# EAGLE schematic PCB (EAGLE 9.6.2)
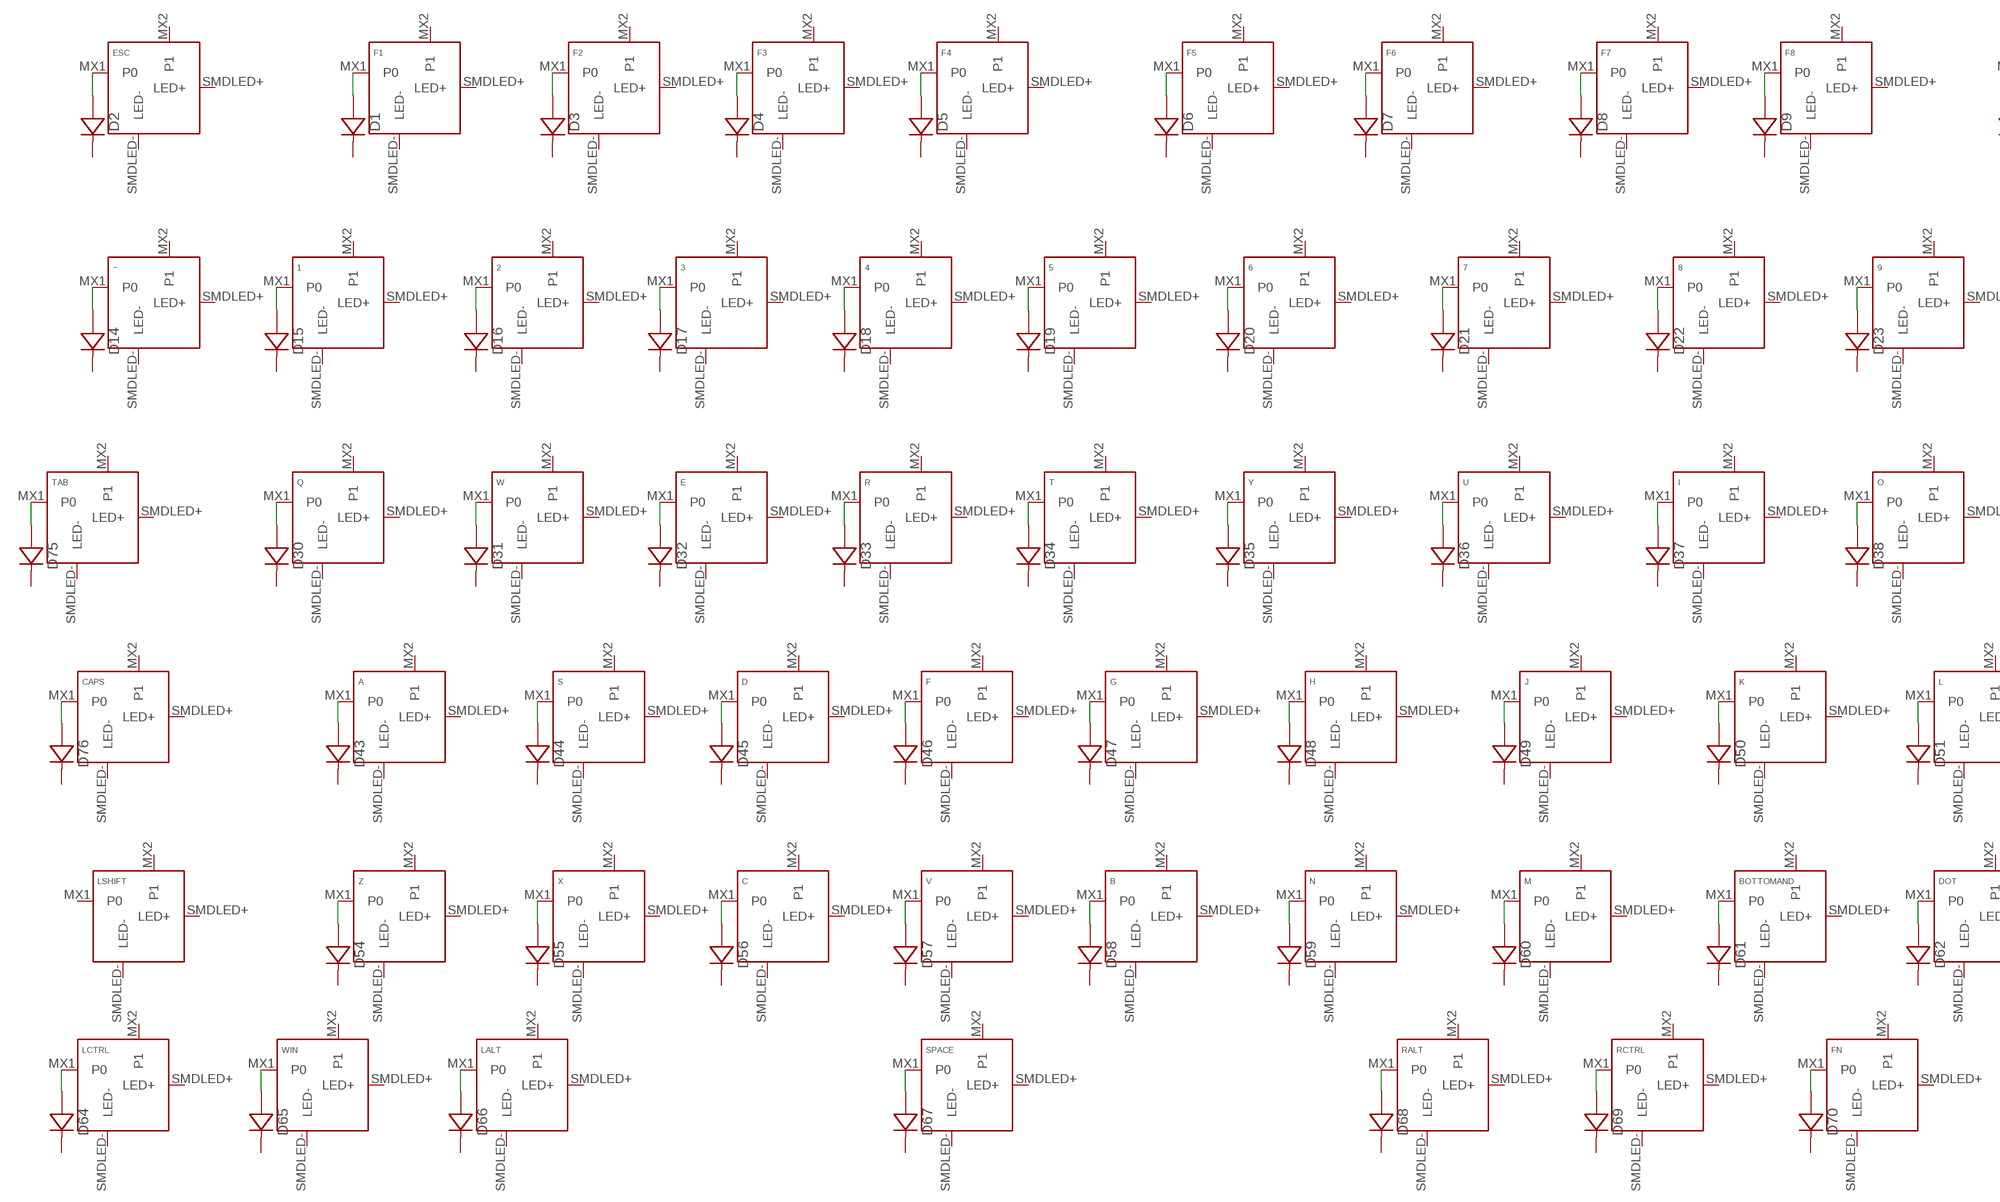
[diagram p0: schematic, sheet 1, part 1 of 2]
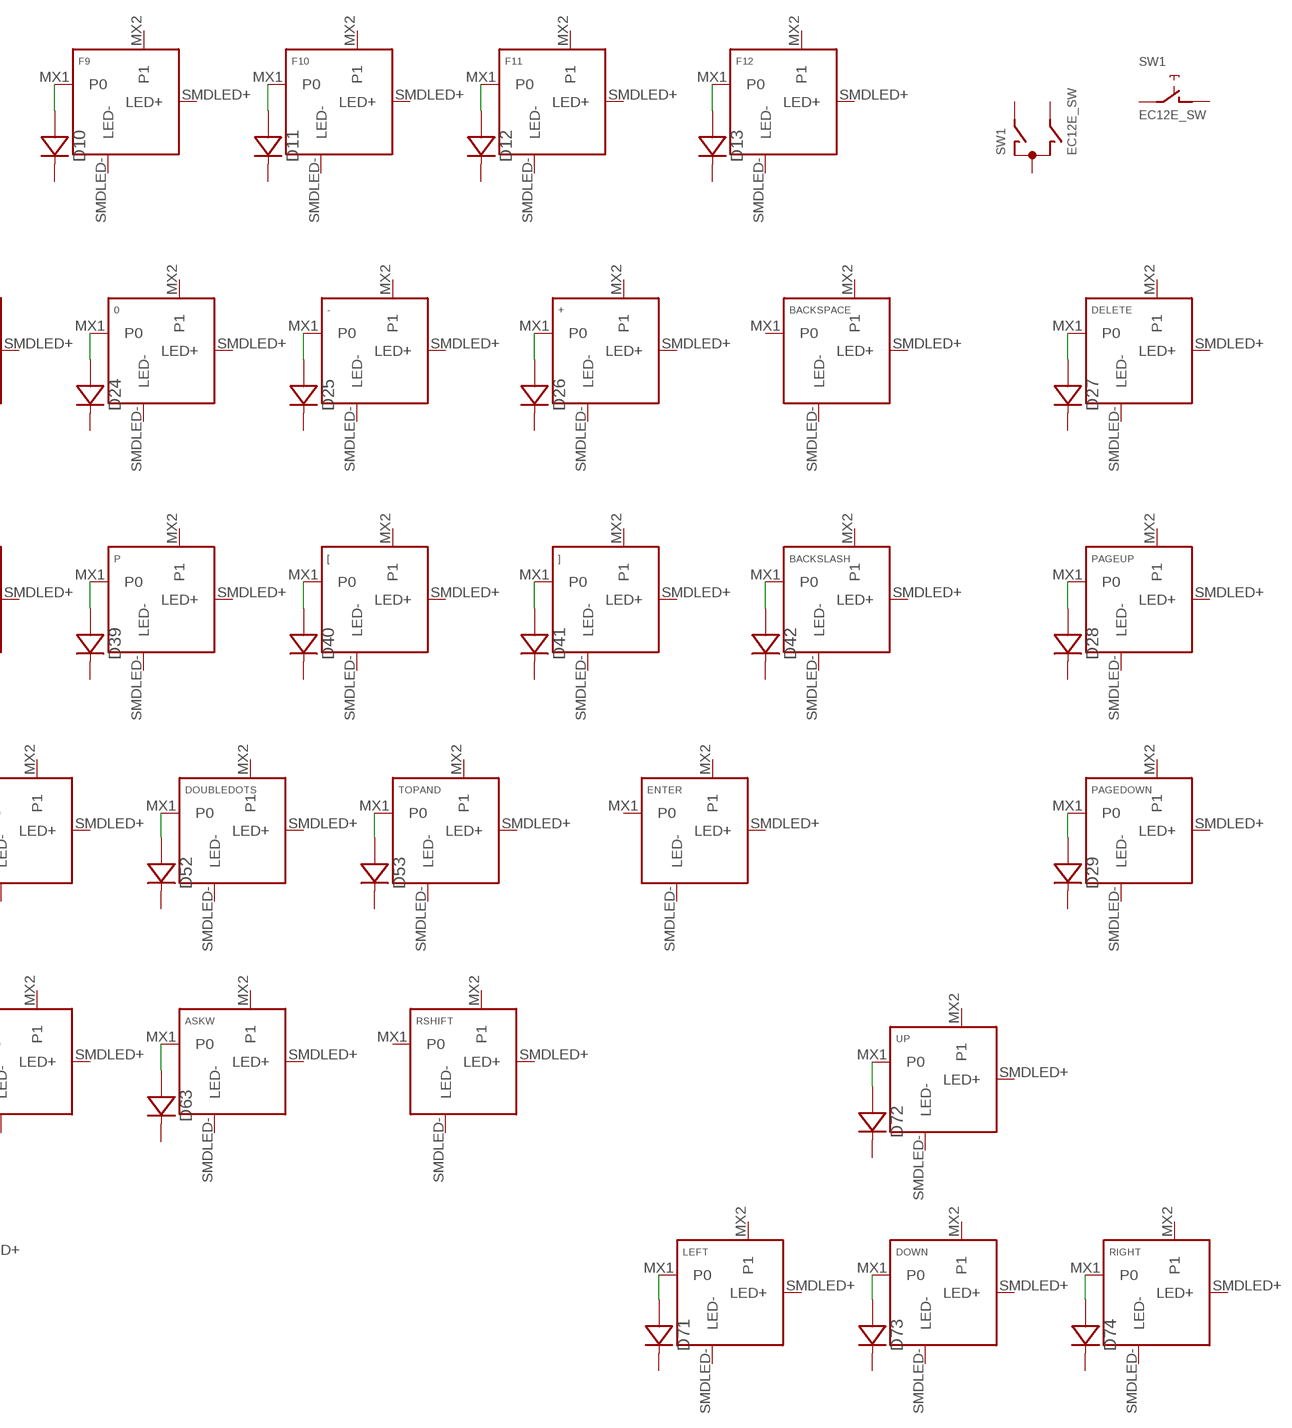
[diagram p1: schematic, sheet 1, part 2 of 2]

## Parts
0  KEYSWITCH-SMDLED-MXHSPCB-1U-SMDLED  [MXHSPCB-1U-SMDLED]
1  KEYSWITCH-SMDLED-MXHSPCB-1U-SMDLED  [MXHSPCB-1U-SMDLED]
2  KEYSWITCH-SMDLED-MXHSPCB-1U-SMDLED  [MXHSPCB-1U-SMDLED]
3  KEYSWITCH-SMDLED-MXHSPCB-1U-SMDLED  [MXHSPCB-1U-SMDLED]
4  KEYSWITCH-SMDLED-MXHSPCB-1U-SMDLED  [MXHSPCB-1U-SMDLED]
5  KEYSWITCH-SMDLED-MXHSPCB-1U-SMDLED  [MXHSPCB-1U-SMDLED]
6  KEYSWITCH-SMDLED-MXHSPCB-1U-SMDLED  [MXHSPCB-1U-SMDLED]
7  KEYSWITCH-SMDLED-MXHSPCB-1U-SMDLED  [MXHSPCB-1U-SMDLED]
8  KEYSWITCH-SMDLED-MXHSPCB-1U-SMDLED  [MXHSPCB-1U-SMDLED]
9  KEYSWITCH-SMDLED-MXHSPCB-1U-SMDLED  [MXHSPCB-1U-SMDLED]
+  KEYSWITCH-SMDLED-MXHSPCB-1U-SMDLED  [MXHSPCB-1U-SMDLED]
-  KEYSWITCH-SMDLED-MXHSPCB-1U-SMDLED  [MXHSPCB-1U-SMDLED]
[  KEYSWITCH-SMDLED-MXHSPCB-1U-SMDLED  [MXHSPCB-1U-SMDLED]
]  KEYSWITCH-SMDLED-MXHSPCB-1U-SMDLED  [MXHSPCB-1U-SMDLED]
A  KEYSWITCH-SMDLED-MXHSPCB-1U-SMDLED  [MXHSPCB-1U-SMDLED]
ASKW  KEYSWITCH-SMDLED-MXHSPCB-1U-SMDLED  [MXHSPCB-1U-SMDLED]
B  KEYSWITCH-SMDLED-MXHSPCB-1U-SMDLED  [MXHSPCB-1U-SMDLED]
BACKSLASH  KEYSWITCH-SMDLED-MXHSPCB-1U-SMDLED  [MXHSPCB-1U-SMDLED]
BACKSPACE  KEYSWITCH-SMDLED-MXHSPCB-2U-SMDLED  [MXHSPCB-2U-SMDLED]
BOTTOMAND  KEYSWITCH-SMDLED-MXHSPCB-1U-SMDLED  [MXHSPCB-1U-SMDLED]
C  KEYSWITCH-SMDLED-MXHSPCB-1U-SMDLED  [MXHSPCB-1U-SMDLED]
CAPS  KEYSWITCH-SMDLED-MXHSPCB-1U-SMDLED  [MXHSPCB-1U-SMDLED]
D  KEYSWITCH-SMDLED-MXHSPCB-1U-SMDLED  [MXHSPCB-1U-SMDLED]
D1  DIODE-SOD-123  [SOD-123]
D2  DIODE-SOD-123  [SOD-123]
D3  DIODE-SOD-123  [SOD-123]
D4  DIODE-SOD-123  [SOD-123]
D5  DIODE-SOD-123  [SOD-123]
D6  DIODE-SOD-123  [SOD-123]
D7  DIODE-SOD-123  [SOD-123]
D8  DIODE-SOD-123  [SOD-123]
D9  DIODE-SOD-123  [SOD-123]
D10  DIODE-SOD-123  [SOD-123]
D11  DIODE-SOD-123  [SOD-123]
D12  DIODE-SOD-123  [SOD-123]
D13  DIODE-SOD-123  [SOD-123]
D14  DIODE-SOD-123  [SOD-123]
D15  DIODE-SOD-123  [SOD-123]
D16  DIODE-SOD-123  [SOD-123]
D17  DIODE-SOD-123  [SOD-123]
D18  DIODE-SOD-123  [SOD-123]
D19  DIODE-SOD-123  [SOD-123]
D20  DIODE-SOD-123  [SOD-123]
D21  DIODE-SOD-123  [SOD-123]
D22  DIODE-SOD-123  [SOD-123]
D23  DIODE-SOD-123  [SOD-123]
D24  DIODE-SOD-123  [SOD-123]
D25  DIODE-SOD-123  [SOD-123]
D26  DIODE-SOD-123  [SOD-123]
D27  DIODE-SOD-123  [SOD-123]
D28  DIODE-SOD-123  [SOD-123]
D29  DIODE-SOD-123  [SOD-123]
D30  DIODE-SOD-123  [SOD-123]
D31  DIODE-SOD-123  [SOD-123]
D32  DIODE-SOD-123  [SOD-123]
D33  DIODE-SOD-123  [SOD-123]
D34  DIODE-SOD-123  [SOD-123]
D35  DIODE-SOD-123  [SOD-123]
D36  DIODE-SOD-123  [SOD-123]
D37  DIODE-SOD-123  [SOD-123]
D38  DIODE-SOD-123  [SOD-123]
D39  DIODE-SOD-123  [SOD-123]
D40  DIODE-SOD-123  [SOD-123]
D41  DIODE-SOD-123  [SOD-123]
D42  DIODE-SOD-123  [SOD-123]
D43  DIODE-SOD-123  [SOD-123]
D44  DIODE-SOD-123  [SOD-123]
D45  DIODE-SOD-123  [SOD-123]
D46  DIODE-SOD-123  [SOD-123]
D47  DIODE-SOD-123  [SOD-123]
D48  DIODE-SOD-123  [SOD-123]
D49  DIODE-SOD-123  [SOD-123]
D50  DIODE-SOD-123  [SOD-123]
D51  DIODE-SOD-123  [SOD-123]
D52  DIODE-SOD-123  [SOD-123]
D53  DIODE-SOD-123  [SOD-123]
D54  DIODE-SOD-123  [SOD-123]
D55  DIODE-SOD-123  [SOD-123]
D56  DIODE-SOD-123  [SOD-123]
D57  DIODE-SOD-123  [SOD-123]
D58  DIODE-SOD-123  [SOD-123]
D59  DIODE-SOD-123  [SOD-123]
D60  DIODE-SOD-123  [SOD-123]
D61  DIODE-SOD-123  [SOD-123]
D62  DIODE-SOD-123  [SOD-123]
D63  DIODE-SOD-123  [SOD-123]
D64  DIODE-SOD-123  [SOD-123]
D65  DIODE-SOD-123  [SOD-123]
D66  DIODE-SOD-123  [SOD-123]
D67  DIODE-SOD-123  [SOD-123]
D68  DIODE-SOD-123  [SOD-123]
D69  DIODE-SOD-123  [SOD-123]
D70  DIODE-SOD-123  [SOD-123]
D71  DIODE-SOD-123  [SOD-123]
D72  DIODE-SOD-123  [SOD-123]
D73  DIODE-SOD-123  [SOD-123]
D74  DIODE-SOD-123  [SOD-123]
D75  DIODE-SOD-123  [SOD-123]
D76  DIODE-SOD-123  [SOD-123]
DELETE  KEYSWITCH-SMDLED-MXHSPCB-1U-SMDLED  [MXHSPCB-1U-SMDLED]
DOT  KEYSWITCH-SMDLED-MXHSPCB-1U-SMDLED  [MXHSPCB-1U-SMDLED]
DOUBLEDOTS  KEYSWITCH-SMDLED-MXHSPCB-1U-SMDLED  [MXHSPCB-1U-SMDLED]
DOWN  KEYSWITCH-SMDLED-MXHSPCB-1U-SMDLED  [MXHSPCB-1U-SMDLED]
E  KEYSWITCH-SMDLED-MXHSPCB-1U-SMDLED  [MXHSPCB-1U-SMDLED]
ENTER  KEYSWITCH-SMDLED-MXHSPCB-2U-SMDLED  [MXHSPCB-2U-SMDLED]
ESC  KEYSWITCH-SMDLED-MXHSPCB-1U-SMDLED  [MXHSPCB-1U-SMDLED]
F  KEYSWITCH-SMDLED-MXHSPCB-1U-SMDLED  [MXHSPCB-1U-SMDLED]
F1  KEYSWITCH-SMDLED-MXHSPCB-1U-SMDLED  [MXHSPCB-1U-SMDLED]
F2  KEYSWITCH-SMDLED-MXHSPCB-1U-SMDLED  [MXHSPCB-1U-SMDLED]
F3  KEYSWITCH-SMDLED-MXHSPCB-1U-SMDLED  [MXHSPCB-1U-SMDLED]
F4  KEYSWITCH-SMDLED-MXHSPCB-1U-SMDLED  [MXHSPCB-1U-SMDLED]
F5  KEYSWITCH-SMDLED-MXHSPCB-1U-SMDLED  [MXHSPCB-1U-SMDLED]
F6  KEYSWITCH-SMDLED-MXHSPCB-1U-SMDLED  [MXHSPCB-1U-SMDLED]
F7  KEYSWITCH-SMDLED-MXHSPCB-1U-SMDLED  [MXHSPCB-1U-SMDLED]
F8  KEYSWITCH-SMDLED-MXHSPCB-1U-SMDLED  [MXHSPCB-1U-SMDLED]
F9  KEYSWITCH-SMDLED-MXHSPCB-1U-SMDLED  [MXHSPCB-1U-SMDLED]
F10  KEYSWITCH-SMDLED-MXHSPCB-1U-SMDLED  [MXHSPCB-1U-SMDLED]
F11  KEYSWITCH-SMDLED-MXHSPCB-1U-SMDLED  [MXHSPCB-1U-SMDLED]
F12  KEYSWITCH-SMDLED-MXHSPCB-1U-SMDLED  [MXHSPCB-1U-SMDLED]
FN  KEYSWITCH-SMDLED-MXHSPCB-1U-SMDLED  [MXHSPCB-1U-SMDLED]
G  KEYSWITCH-SMDLED-MXHSPCB-1U-SMDLED  [MXHSPCB-1U-SMDLED]
H  KEYSWITCH-SMDLED-MXHSPCB-1U-SMDLED  [MXHSPCB-1U-SMDLED]
I  KEYSWITCH-SMDLED-MXHSPCB-1U-SMDLED  [MXHSPCB-1U-SMDLED]
J  KEYSWITCH-SMDLED-MXHSPCB-1U-SMDLED  [MXHSPCB-1U-SMDLED]
K  KEYSWITCH-SMDLED-MXHSPCB-1U-SMDLED  [MXHSPCB-1U-SMDLED]
L  KEYSWITCH-SMDLED-MXHSPCB-1U-SMDLED  [MXHSPCB-1U-SMDLED]
LALT  KEYSWITCH-SMDLED-MXHSPCB-1U-SMDLED  [MXHSPCB-1U-SMDLED]
LCTRL  KEYSWITCH-SMDLED-MXHSPCB-1U-SMDLED  [MXHSPCB-1U-SMDLED]
LEFT  KEYSWITCH-SMDLED-MXHSPCB-1U-SMDLED  [MXHSPCB-1U-SMDLED]
LSHIFT  KEYSWITCH-SMDLED-MXHSPCB-2U-SMDLED  [MXHSPCB-2U-SMDLED]
M  KEYSWITCH-SMDLED-MXHSPCB-1U-SMDLED  [MXHSPCB-1U-SMDLED]
N  KEYSWITCH-SMDLED-MXHSPCB-1U-SMDLED  [MXHSPCB-1U-SMDLED]
O  KEYSWITCH-SMDLED-MXHSPCB-1U-SMDLED  [MXHSPCB-1U-SMDLED]
P  KEYSWITCH-SMDLED-MXHSPCB-1U-SMDLED  [MXHSPCB-1U-SMDLED]
PAGEDOWN  KEYSWITCH-SMDLED-MXHSPCB-1U-SMDLED  [MXHSPCB-1U-SMDLED]
PAGEUP  KEYSWITCH-SMDLED-MXHSPCB-1U-SMDLED  [MXHSPCB-1U-SMDLED]
Q  KEYSWITCH-SMDLED-MXHSPCB-1U-SMDLED  [MXHSPCB-1U-SMDLED]
R  KEYSWITCH-SMDLED-MXHSPCB-1U-SMDLED  [MXHSPCB-1U-SMDLED]
RALT  KEYSWITCH-SMDLED-MXHSPCB-1U-SMDLED  [MXHSPCB-1U-SMDLED]
RCTRL  KEYSWITCH-SMDLED-MXHSPCB-1U-SMDLED  [MXHSPCB-1U-SMDLED]
RIGHT  KEYSWITCH-SMDLED-MXHSPCB-1U-SMDLED  [MXHSPCB-1U-SMDLED]
RSHIFT  KEYSWITCH-SMDLED-MXHSPCB-2U-SMDLED  [MXHSPCB-2U-SMDLED]
S  KEYSWITCH-SMDLED-MXHSPCB-1U-SMDLED  [MXHSPCB-1U-SMDLED]
SPACE  KEYSWITCH-SMDLED-MXHSPCB-6.25U-SMDLED-FLIPPED  [MXHSPCB-6.25U-SMDLED-FLIPPED]
SW1  EC12E_SW  [ALPS_EC12E_SW]
T  KEYSWITCH-SMDLED-MXHSPCB-1U-SMDLED  [MXHSPCB-1U-SMDLED]
TAB  KEYSWITCH-SMDLED-MXHSPCB-1U-SMDLED  [MXHSPCB-1U-SMDLED]
TOPAND  KEYSWITCH-SMDLED-MXHSPCB-1U-SMDLED  [MXHSPCB-1U-SMDLED]
U  KEYSWITCH-SMDLED-MXHSPCB-1U-SMDLED  [MXHSPCB-1U-SMDLED]
UP  KEYSWITCH-SMDLED-MXHSPCB-1U-SMDLED  [MXHSPCB-1U-SMDLED]
V  KEYSWITCH-SMDLED-MXHSPCB-1U-SMDLED  [MXHSPCB-1U-SMDLED]
W  KEYSWITCH-SMDLED-MXHSPCB-1U-SMDLED  [MXHSPCB-1U-SMDLED]
WIN  KEYSWITCH-SMDLED-MXHSPCB-1U-SMDLED  [MXHSPCB-1U-SMDLED]
X  KEYSWITCH-SMDLED-MXHSPCB-1U-SMDLED  [MXHSPCB-1U-SMDLED]
Y  KEYSWITCH-SMDLED-MXHSPCB-1U-SMDLED  [MXHSPCB-1U-SMDLED]
Z  KEYSWITCH-SMDLED-MXHSPCB-1U-SMDLED  [MXHSPCB-1U-SMDLED]
~  KEYSWITCH-SMDLED-MXHSPCB-1U-SMDLED  [MXHSPCB-1U-SMDLED]

## Nets
N$1: D2.A ESC.MX1(P0)
N$2: D1.A F1.MX1(P0)
N$3: D3.A F2.MX1(P0)
N$4: D4.A F3.MX1(P0)
N$5: D5.A F4.MX1(P0)
N$6: D6.A F5.MX1(P0)
N$7: D7.A F6.MX1(P0)
N$8: D8.A F7.MX1(P0)
N$9: D9.A F8.MX1(P0)
N$10: D10.A F9.MX1(P0)
N$11: D11.A F10.MX1(P0)
N$12: D12.A F11.MX1(P0)
N$13: D13.A F12.MX1(P0)
N$14: D14.A ~.MX1(P0)
N$15: 1.MX1(P0) D15.A
N$16: 2.MX1(P0) D16.A
N$17: 3.MX1(P0) D17.A
N$18: 4.MX1(P0) D18.A
N$19: 5.MX1(P0) D19.A
N$20: 6.MX1(P0) D20.A
N$21: 7.MX1(P0) D21.A
N$22: 8.MX1(P0) D22.A
N$23: 9.MX1(P0) D23.A
N$24: 0.MX1(P0) D24.A
N$25: -.MX1(P0) D25.A
N$26: +.MX1(P0) D26.A
N$27: D27.A DELETE.MX1(P0)
N$28: D28.A PAGEUP.MX1(P0)
N$29: D29.A PAGEDOWN.MX1(P0)
N$30: D30.A Q.MX1(P0)
N$31: D31.A W.MX1(P0)
N$32: D32.A E.MX1(P0)
N$33: D33.A R.MX1(P0)
N$34: D34.A T.MX1(P0)
N$35: D35.A Y.MX1(P0)
N$36: D36.A U.MX1(P0)
N$37: D37.A I.MX1(P0)
N$38: D38.A O.MX1(P0)
N$39: D39.A P.MX1(P0)
N$40: [.MX1(P0) D40.A
N$41: ].MX1(P0) D41.A
N$42: BACKSLASH.MX1(P0) D42.A
N$43: A.MX1(P0) D43.A
N$44: D44.A S.MX1(P0)
N$45: D45.A D.MX1(P0)
N$46: D46.A F.MX1(P0)
N$47: D47.A G.MX1(P0)
N$48: D48.A H.MX1(P0)
N$49: D49.A J.MX1(P0)
N$50: D50.A K.MX1(P0)
N$51: D51.A L.MX1(P0)
N$52: D52.A DOUBLEDOTS.MX1(P0)
N$53: D53.A TOPAND.MX1(P0)
N$54: D54.A Z.MX1(P0)
N$55: D55.A X.MX1(P0)
N$56: C.MX1(P0) D56.A
N$57: D57.A V.MX1(P0)
N$58: B.MX1(P0) D58.A
N$59: D59.A N.MX1(P0)
N$60: D60.A M.MX1(P0)
N$61: BOTTOMAND.MX1(P0) D61.A
N$62: D62.A DOT.MX1(P0)
N$63: ASKW.MX1(P0) D63.A
N$64: D64.A LCTRL.MX1(P0)
N$65: D65.A WIN.MX1(P0)
N$66: D66.A LALT.MX1(P0)
N$67: D67.A SPACE.MX1(P0)
N$68: D68.A RALT.MX1(P0)
N$69: D69.A RCTRL.MX1(P0)
N$70: D70.A FN.MX1(P0)
N$71: D71.A LEFT.MX1(P0)
N$72: D72.A UP.MX1(P0)
N$73: D73.A DOWN.MX1(P0)
N$74: D74.A RIGHT.MX1(P0)
N$75: D75.A TAB.MX1(P0)
N$76: CAPS.MX1(P0) D76.A
Unconnected: 0.MX2(P1) 0.SMDLED+(LED+) 0.SMDLED-(LED-) 1.MX2(P1) 1.SMDLED+(LED+) 1.SMDLED-(LED-) 2.MX2(P1) 2.SMDLED+(LED+) 2.SMDLED-(LED-) 3.MX2(P1) 3.SMDLED+(LED+) 3.SMDLED-(LED-) 4.MX2(P1) 4.SMDLED+(LED+) 4.SMDLED-(LED-) 5.MX2(P1) 5.SMDLED+(LED+) 5.SMDLED-(LED-) 6.MX2(P1) 6.SMDLED+(LED+) 6.SMDLED-(LED-) 7.MX2(P1) 7.SMDLED+(LED+) 7.SMDLED-(LED-) 8.MX2(P1) 8.SMDLED+(LED+) 8.SMDLED-(LED-) 9.MX2(P1) 9.SMDLED+(LED+) 9.SMDLED-(LED-) +.MX2(P1) +.SMDLED+(LED+) +.SMDLED-(LED-) -.MX2(P1) -.SMDLED+(LED+) -.SMDLED-(LED-) [.MX2(P1) [.SMDLED+(LED+) [.SMDLED-(LED-) ].MX2(P1) ].SMDLED+(LED+) ].SMDLED-(LED-) A.MX2(P1) A.SMDLED+(LED+) A.SMDLED-(LED-) ASKW.MX2(P1) ASKW.SMDLED+(LED+) ASKW.SMDLED-(LED-) B.MX2(P1) B.SMDLED+(LED+) B.SMDLED-(LED-) BACKSLASH.MX2(P1) BACKSLASH.SMDLED+(LED+) BACKSLASH.SMDLED-(LED-) BACKSPACE.MX1(P0) BACKSPACE.MX2(P1) BACKSPACE.SMDLED+(LED+) BACKSPACE.SMDLED-(LED-) BOTTOMAND.MX2(P1) BOTTOMAND.SMDLED+(LED+) BOTTOMAND.SMDLED-(LED-) C.MX2(P1) C.SMDLED+(LED+) C.SMDLED-(LED-) CAPS.MX2(P1) CAPS.SMDLED+(LED+) CAPS.SMDLED-(LED-) D1.C D2.C D3.C D4.C D5.C D6.C D7.C D8.C D9.C D10.C D11.C D12.C D13.C D14.C D15.C D16.C D17.C D18.C D19.C D20.C D21.C D22.C D23.C D24.C D25.C D26.C D27.C D28.C D29.C D30.C D31.C D32.C D33.C D34.C D35.C D36.C D37.C D38.C D39.C D40.C D41.C D42.C D43.C D44.C D45.C D46.C D47.C D48.C D49.C D50.C D51.C D52.C D53.C D54.C D55.C D56.C D57.C D58.C D59.C D60.C D61.C D62.C D63.C D64.C D65.C D66.C D67.C D68.C D69.C D70.C D71.C D72.C D73.C D74.C D75.C D76.C D.MX2(P1) D.SMDLED+(LED+) D.SMDLED-(LED-) DELETE.MX2(P1) DELETE.SMDLED+(LED+) DELETE.SMDLED-(LED-) DOT.MX2(P1) DOT.SMDLED+(LED+) DOT.SMDLED-(LED-) DOUBLEDOTS.MX2(P1) DOUBLEDOTS.SMDLED+(LED+) DOUBLEDOTS.SMDLED-(LED-) DOWN.MX2(P1) DOWN.SMDLED+(LED+) DOWN.SMDLED-(LED-) E.MX2(P1) E.SMDLED+(LED+) E.SMDLED-(LED-) ENTER.MX1(P0) ENTER.MX2(P1) ENTER.SMDLED+(LED+) ENTER.SMDLED-(LED-) ESC.MX2(P1) ESC.SMDLED+(LED+) ESC.SMDLED-(LED-) F1.MX2(P1) F1.SMDLED+(LED+) F1.SMDLED-(LED-) F2.MX2(P1) F2.SMDLED+(LED+) F2.SMDLED-(LED-) F3.MX2(P1) F3.SMDLED+(LED+) F3.SMDLED-(LED-) F4.MX2(P1) F4.SMDLED+(LED+) F4.SMDLED-(LED-) F5.MX2(P1) F5.SMDLED+(LED+) F5.SMDLED-(LED-) F6.MX2(P1) F6.SMDLED+(LED+) F6.SMDLED-(LED-) F7.MX2(P1) F7.SMDLED+(LED+) F7.SMDLED-(LED-) F8.MX2(P1) F8.SMDLED+(LED+) F8.SMDLED-(LED-) F9.MX2(P1) F9.SMDLED+(LED+) F9.SMDLED-(LED-) F10.MX2(P1) F10.SMDLED+(LED+) F10.SMDLED-(LED-) F11.MX2(P1) F11.SMDLED+(LED+) F11.SMDLED-(LED-) F12.MX2(P1) F12.SMDLED+(LED+) F12.SMDLED-(LED-) F.MX2(P1) F.SMDLED+(LED+) F.SMDLED-(LED-) FN.MX2(P1) FN.SMDLED+(LED+) FN.SMDLED-(LED-) G.MX2(P1) G.SMDLED+(LED+) G.SMDLED-(LED-) H.MX2(P1) H.SMDLED+(LED+) H.SMDLED-(LED-) I.MX2(P1) I.SMDLED+(LED+) I.SMDLED-(LED-) J.MX2(P1) J.SMDLED+(LED+) J.SMDLED-(LED-) K.MX2(P1) K.SMDLED+(LED+) K.SMDLED-(LED-) L.MX2(P1) L.SMDLED+(LED+) L.SMDLED-(LED-) LALT.MX2(P1) LALT.SMDLED+(LED+) LALT.SMDLED-(LED-) LCTRL.MX2(P1) LCTRL.SMDLED+(LED+) LCTRL.SMDLED-(LED-) LEFT.MX2(P1) LEFT.SMDLED+(LED+) LEFT.SMDLED-(LED-) LSHIFT.MX1(P0) LSHIFT.MX2(P1) LSHIFT.SMDLED+(LED+) LSHIFT.SMDLED-(LED-) M.MX2(P1) M.SMDLED+(LED+) M.SMDLED-(LED-) N.MX2(P1) N.SMDLED+(LED+) N.SMDLED-(LED-) O.MX2(P1) O.SMDLED+(LED+) O.SMDLED-(LED-) P.MX2(P1) P.SMDLED+(LED+) P.SMDLED-(LED-) PAGEDOWN.MX2(P1) PAGEDOWN.SMDLED+(LED+) PAGEDOWN.SMDLED-(LED-) PAGEUP.MX2(P1) PAGEUP.SMDLED+(LED+) PAGEUP.SMDLED-(LED-) Q.MX2(P1) Q.SMDLED+(LED+) Q.SMDLED-(LED-) R.MX2(P1) R.SMDLED+(LED+) R.SMDLED-(LED-) RALT.MX2(P1) RALT.SMDLED+(LED+) RALT.SMDLED-(LED-) RCTRL.MX2(P1) RCTRL.SMDLED+(LED+) RCTRL.SMDLED-(LED-) RIGHT.MX2(P1) RIGHT.SMDLED+(LED+) RIGHT.SMDLED-(LED-) RSHIFT.MX1(P0) RSHIFT.MX2(P1) RSHIFT.SMDLED+(LED+) RSHIFT.SMDLED-(LED-) S.MX2(P1) S.SMDLED+(LED+) S.SMDLED-(LED-) SPACE.MX2(P1) SPACE.SMDLED+(LED+) SPACE.SMDLED-(LED-) SW1.A SW1.B SW1.C SW1.D SW1.E SW1.GND1(G) SW1.GND2(G) T.MX2(P1) T.SMDLED+(LED+) T.SMDLED-(LED-) TAB.MX2(P1) TAB.SMDLED+(LED+) TAB.SMDLED-(LED-) TOPAND.MX2(P1) TOPAND.SMDLED+(LED+) TOPAND.SMDLED-(LED-) U.MX2(P1) U.SMDLED+(LED+) U.SMDLED-(LED-) UP.MX2(P1) UP.SMDLED+(LED+) UP.SMDLED-(LED-) V.MX2(P1) V.SMDLED+(LED+) V.SMDLED-(LED-) W.MX2(P1) W.SMDLED+(LED+) W.SMDLED-(LED-) WIN.MX2(P1) WIN.SMDLED+(LED+) WIN.SMDLED-(LED-) X.MX2(P1) X.SMDLED+(LED+) X.SMDLED-(LED-) Y.MX2(P1) Y.SMDLED+(LED+) Y.SMDLED-(LED-) Z.MX2(P1) Z.SMDLED+(LED+) Z.SMDLED-(LED-) ~.MX2(P1) ~.SMDLED+(LED+) ~.SMDLED-(LED-)

## Library data of the parts
0 1-9 + - [ ] A ASKW B BACKSLASH BACKSPACE BOTTOMAND C CAPS D DELETE DOT DOUBLEDOTS DOWN E ENTER ESC F F1-F12 FN G H I J K L LALT LCTRL LEFT LSHIFT M N O P PAGEDOWN PAGEUP Q R RALT RCTRL RIGHT RSHIFT S SPACE T TAB TOPAND U UP V W WIN X Y Z ~ = Keyboard:KEYSWITCH-SMDLED
D1-D76 = Components:DIODE: Standard 1N4148 diode
SW1 = switch-alps:EC12E_SW: ALPS rotary Encoder EC12E series with switch; MPN: EC12E2424407; OC_FARNELL: 1520813; OC_NEWARK: 74M1068